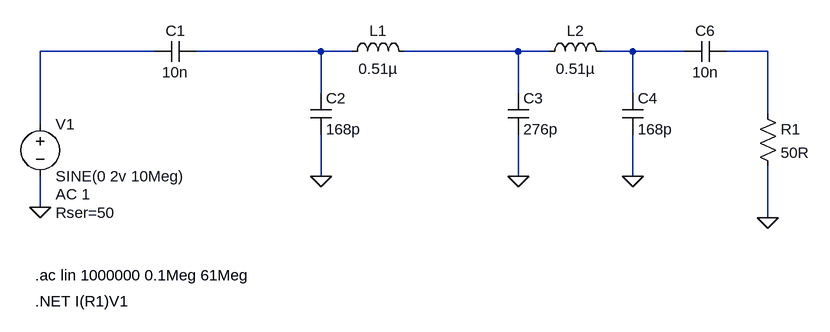
[diagram p0: schematic 15m_lpf.asc]
15m_lpf.asc, the LTspice schematic file:
Version 4
SHEET 1 1156 680
WIRE 144 32 -32 32
WIRE 400 32 208 32
WIRE 448 32 400 32
WIRE 704 32 528 32
WIRE 752 32 704 32
WIRE 880 32 832 32
WIRE 960 32 880 32
WIRE 1088 32 1024 32
WIRE 400 96 400 32
WIRE 704 96 704 32
WIRE 880 96 880 32
WIRE 1088 128 1088 32
WIRE -32 144 -32 32
WIRE 400 224 400 160
WIRE 704 224 704 160
WIRE 880 224 880 160
WIRE -32 272 -32 224
WIRE 1088 288 1088 208
FLAG -32 272 0
FLAG 1088 288 0
FLAG 400 224 0
FLAG 704 224 0
FLAG 880 224 0
SYMBOL voltage -32 128 R0
WINDOW 123 24 124 Left 2
WINDOW 39 24 152 Left 2
SYMATTR Value2 AC 1
SYMATTR SpiceLine Rser=50
SYMATTR InstName V1
SYMATTR Value SINE(0 2v 10Meg)
SYMBOL cap 208 16 R90
WINDOW 0 0 32 VBottom 2
WINDOW 3 32 32 VTop 2
SYMATTR InstName C1
SYMATTR Value 10n
SYMBOL res 1072 112 R0
SYMATTR InstName R1
SYMATTR Value 50R
SYMBOL cap 384 96 R0
SYMATTR InstName C2
SYMATTR Value 168p
SYMBOL cap 688 96 R0
SYMATTR InstName C3
SYMATTR Value 276p
SYMBOL cap 864 96 R0
SYMATTR InstName C4
SYMATTR Value 168p
SYMBOL ind 432 48 R270
WINDOW 0 32 56 VTop 2
WINDOW 3 5 56 VBottom 2
SYMATTR InstName L1
SYMATTR Value 0.51µ
SYMBOL ind 736 48 R270
WINDOW 0 32 56 VTop 2
WINDOW 3 5 56 VBottom 2
SYMATTR InstName L2
SYMATTR Value 0.51µ
SYMBOL cap 1024 16 R90
WINDOW 0 0 32 VBottom 2
WINDOW 3 32 32 VTop 2
SYMATTR InstName C6
SYMATTR Value 10n
TEXT -40 376 Left 2 !.ac lin 1000000 0.1Meg 61Meg
TEXT -40 416 Left 2 !.NET I(R1)V1

The netlist it stands for:
* 15m_lpf.asc
V1 N001 0 SINE(0 2v 10Meg) AC 1 Rser=50
C1 N002 N001 10n
R1 N005 0 50R
C2 N002 0 168p
C3 N003 0 276p
C4 N004 0 168p
L1 N002 N003 0.51µ
L2 N003 N004 0.51µ
C6 N005 N004 10n
.ac lin 1000000 0.1Meg 61Meg
.NET I(R1)V1
.backanno
.end